# EAGLE design Router (EAGLE 6.3)
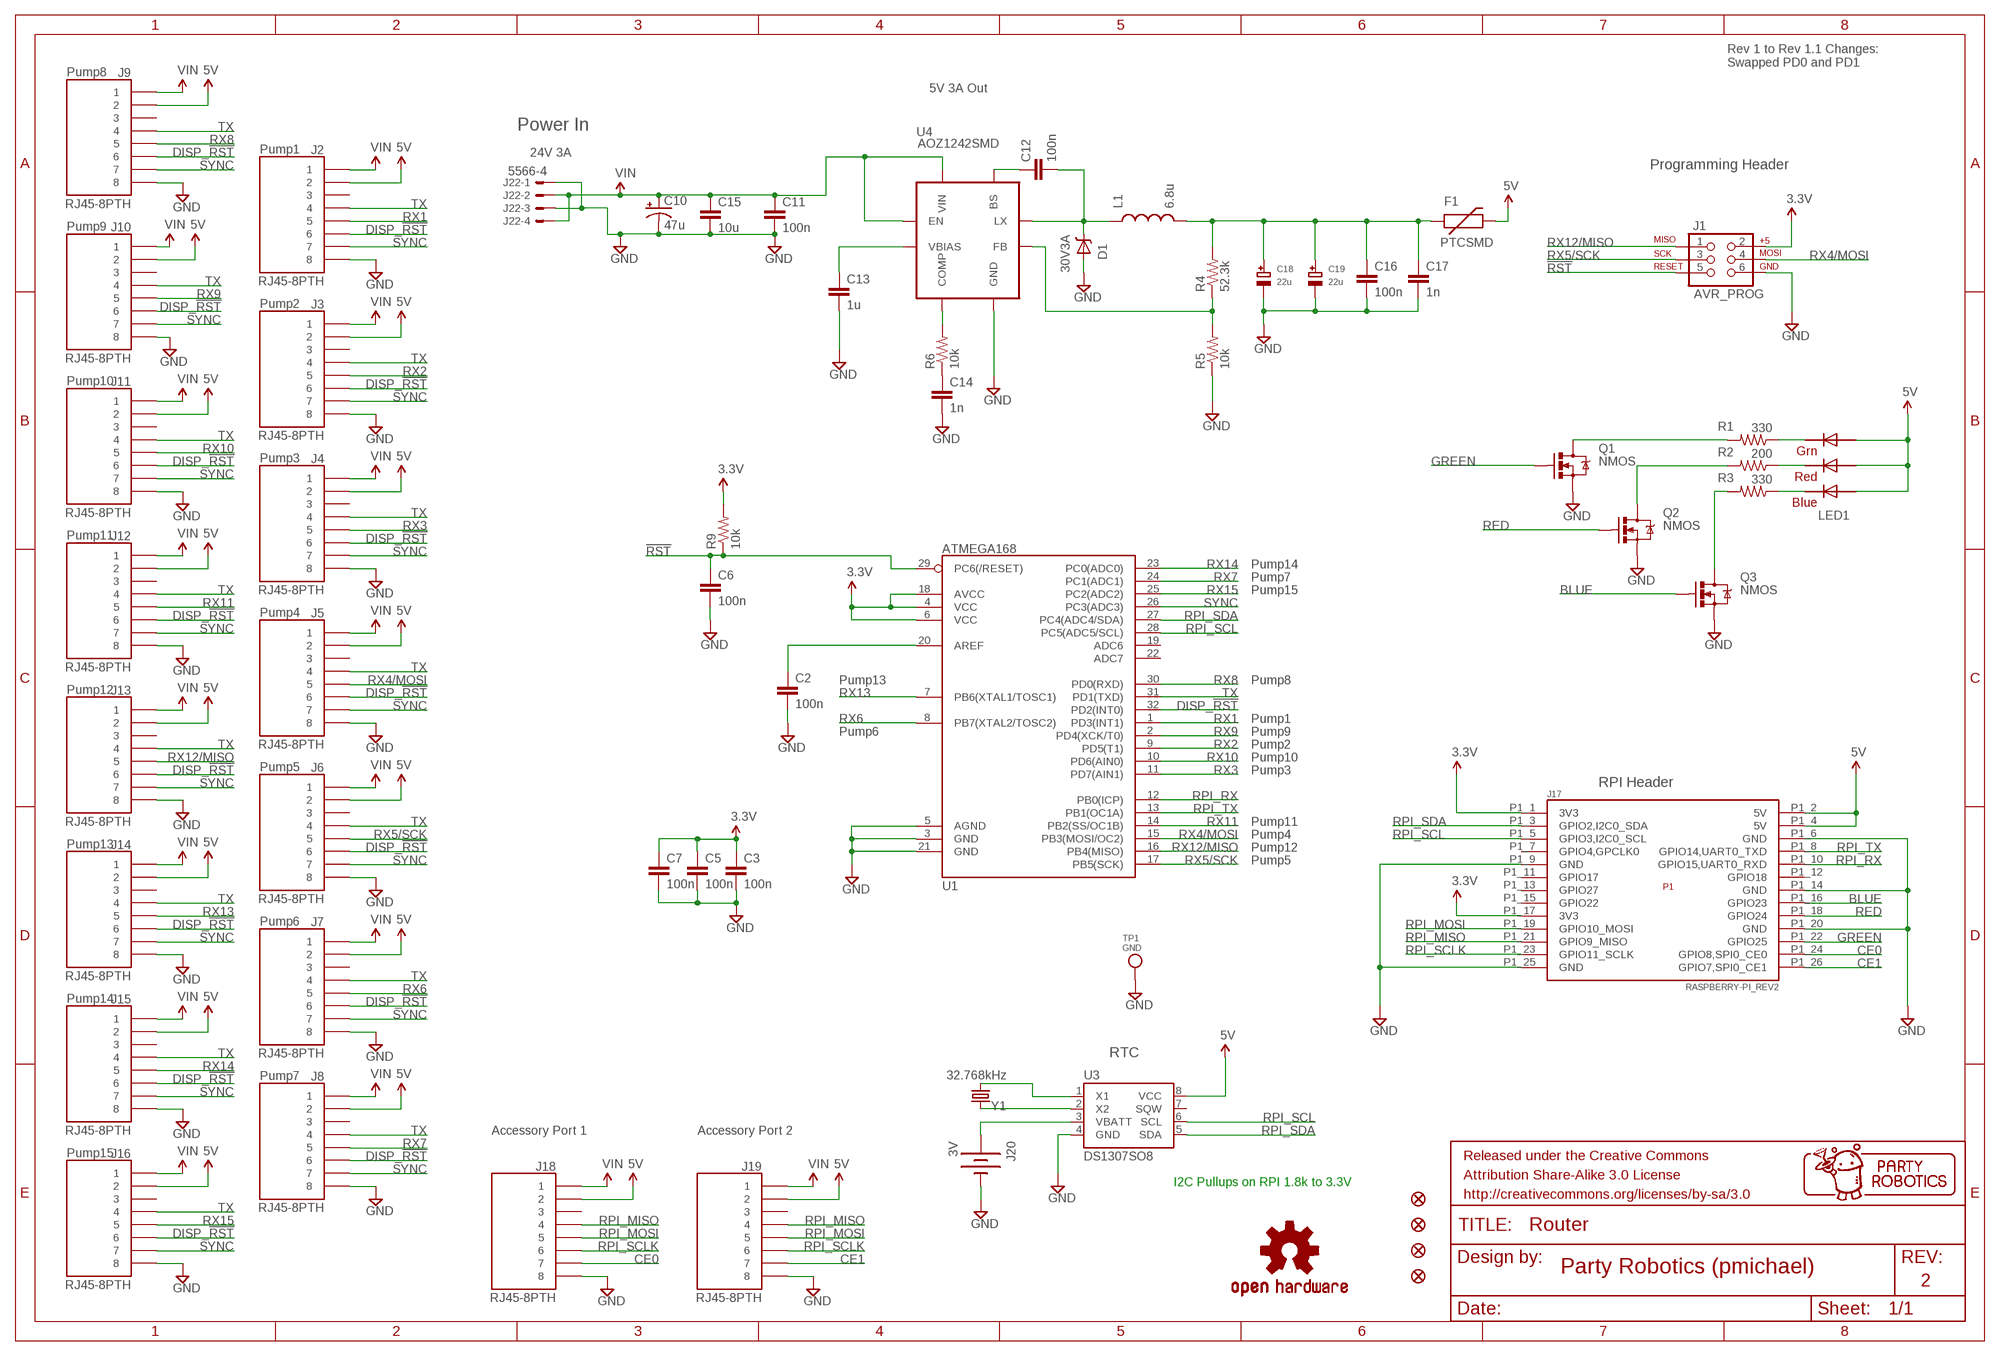
[diagram p0: schematic, sheet 1]

## Parts
C2  100n  CAP0603-CAP  [0603-CAP]
C3  100n  CAP0603-CAP  [0603-CAP]
C5  100n  CAP0603-CAP  [0603-CAP]
C6  100n  CAP0603-CAP  [0603-CAP]
C7  100n  CAP0603-CAP  [0603-CAP]
C10  47u  CAP_POLD  [PANASONIC_D]
C11  100n  CAP0603-CAP  [0603-CAP]
C12  100n  CAP0603-CAP  [0603-CAP]
C13  1u  CAP0603-CAP  [0603-CAP]
C14  1n  CAP0603-CAP  [0603-CAP]
C15  10u  CAP1206  [1206]
C16  100n  CAP0603-CAP  [0603-CAP]
C17  1n  CAP0603-CAP  [0603-CAP]
C18  22u  CAP_TANTALUMC/6032_REFLOW  [EIA6032-28/C-R]
C19  22u  CAP_TANTALUMC/6032_REFLOW  [EIA6032-28/C-R]
D1  30V3A  B330A  [SMA-DIODE]
F1  PTCSMD  [PTC-1206]
FRAME3  FRAME-LETTER  [CREATIVE_COMMONS]
J1  AVR_PROG  AVR_SPI_PRG_62X3_LOCK  [2X3_LOCK]
J2  RJ45-8PTH  [RJ45-8]
J3  RJ45-8PTH  [RJ45-8]
J4  RJ45-8PTH  [RJ45-8]
J5  RJ45-8PTH  [RJ45-8]
J6  RJ45-8PTH  [RJ45-8]
J7  RJ45-8PTH  [RJ45-8]
J8  RJ45-8PTH  [RJ45-8]
J9  RJ45-8PTH  [RJ45-8]
J10  RJ45-8PTH  [RJ45-8]
J11  RJ45-8PTH  [RJ45-8]
J12  RJ45-8PTH  [RJ45-8]
J13  RJ45-8PTH  [RJ45-8]
J14  RJ45-8PTH  [RJ45-8]
J15  RJ45-8PTH  [RJ45-8]
J16  RJ45-8PTH  [RJ45-8]
J17  RASPBERRY-PI_REV2  [RASPBERRY-PI_REV2]
J18  RJ45-8PTH  [RJ45-8]
J19  RJ45-8PTH  [RJ45-8]
J20  3V  BATTERY12PTH  [BATTCON_12MM_PTH]
J22  5566-4  [5566-4]
JP1  FIDUCIAL1.5X3  [FIDUCIAL-1.5X3]
JP2  FIDUCIAL1.5X3  [FIDUCIAL-1.5X3]
JP3  FIDUCIAL1.5X3  [FIDUCIAL-1.5X3]
JP4  FIDUCIAL1.5X3  [FIDUCIAL-1.5X3]
L1  6.8u  INDUCTORCR54  [IND_8X8X4]
LED1  RGBLED5050  [RGBLED5050]
Q1  NMOS  MOSFET-NCHANNELSMD  [SOT23-3]
Q2  NMOS  MOSFET-NCHANNELSMD  [SOT23-3]
Q3  NMOS  MOSFET-NCHANNELSMD  [SOT23-3]
R1  330  RESISTOR0603-RES  [0603-RES]
R2  200  RESISTOR0603-RES  [0603-RES]
R3  330  RESISTOR0603-RES  [0603-RES]
R4  52.3k  RESISTOR0603-RES  [0603-RES]
R5  10k  RESISTOR0603-RES  [0603-RES]
R6  10k  RESISTOR0603-RES  [0603-RES]
R9  10k  RESISTOR0603-RES  [0603-RES]
TP1  GND  TESTPOINT  [TESTPOINT_SMT]
U1  ATMEGA168  [TQFP32-08]
U3  DS1307SO8  [SO08]
U4  AOZ1242SMD  [SO08]
U$46  OSHW-LOGOM  [OSHW-LOGO-M]
Y1  32.768kHz  CRYSTALTC26H_EZ  [TC26HEZ]

## Nets
3.3V: C3.1 C5.1 C7.1 J1.2 J17.P1_1(3V3) J17.P1_17(3V3) R9.2 U1.4(VCC) U1.6(VCC) U1.18(AVCC)
5V: F1.2 J2.2 J3.2 J4.2 J5.2 J6.2 J7.2 J8.2 J9.2 J10.2 J11.2 J12.2 J13.2 J14.2 J15.2 J16.2 J17.P1_2(5V) J17.P1_4(5V) J18.2 J19.2 LED1.1(BLUE_A) LED1.2(RED_A) LED1.3(GREEN_A) U3.8(VCC)
!RST: C6.1 J1.5 R9.1 U1.29(PC6(/RESET))
BAT1+: J20.VCC@1(+) U3.3(VBATT)
BLUE: J17.P1_16(GPIO23) Q3.1(G)
CE0: J17.P1_24(GPIO8,SPI0_CE0) J18.7
CE1: J17.P1_26(GPIO7,SPI0_CE1) J19.7
DISP_!RST: J2.6 J3.6 J4.6 J5.6 J6.6 J7.6 J8.6 J9.6 J10.6 J11.6 J12.6 J13.6 J14.6 J15.6 J16.6 U1.32(PD2(INT0))
GND: C2.2 C3.2 C5.2 C6.2 C7.2 C10.- C11.2 C13.2 C14.2 C15.2 C16.2 C17.2 C18.- C19.- D1.A J1.6 J2.8 J3.8 J4.8 J5.8 J6.8 J7.8 J8.8 J9.8 J10.8 J11.8 J12.8 J13.8 J14.8 J15.8 J16.8 J17.P1_6(GND) J17.P1_9(GND) J17.P1_14(GND) J17.P1_20(GND) J17.P1_25(GND) J18.8 J19.8 J20.GND(-) J22.1 J22.3 Q1.2(S) Q2.2(S) Q3.2(S) R5.1 TP1.P$1 U1.3(GND) U1.5(AGND) U1.21(GND) U3.4(GND) U4.3(GND)
GREEN: J17.P1_22(GPIO25) Q1.1(G)
N$1: U3.2(X2) Y1.1
N$2: R4.1 R5.2 U4.4(FB)
N$3: R6.2 U4.5(COMP)
N$4: C2.1 U1.20(AREF)
N$5: C16.1 C17.1 C18.+ C19.+ F1.1 L1.P$2 R4.2
N$6: U3.1(X1) Y1.2
N$7: C12.1 U4.2(BS)
N$8: C13.1 U4.8(VBIAS)
N$9: LED1.4(GREEN_C) R1.1
N$10: Q1.3(D) R1.2
N$11: Q2.3(D) R2.2
N$12: LED1.5(RED_C) R2.1
N$13: LED1.6(BLUE_C) R3.1
N$14: Q3.3(D) R3.2
N$15: C14.1 R6.1
N$16: C12.2 D1.C L1.P$1 U4.1(LX)
RED: J17.P1_18(GPIO24) Q2.1(G)
RPI_MISO: J17.P1_21(GPIO9_MISO) J18.4 J19.4
RPI_MOSI: J17.P1_19(GPIO10_MOSI) J18.5 J19.5
RPI_RX: J17.P1_10(GPIO15,UART0_RXD) U1.12(PB0(ICP))
RPI_SCL: J17.P1_5(GPIO3,I2C0_SCL) U1.28(PC5(ADC5/SCL)) U3.6(SCL)
RPI_SCLK: J17.P1_23(GPIO11_SCLK) J18.6 J19.6
RPI_SDA: J17.P1_3(GPIO2,I2C0_SDA) U1.27(PC4(ADC4/SDA)) U3.5(SDA)
RPI_TX: J17.P1_8(GPIO14,UART0_TXD) U1.13(PB1(OC1A))
RX1: J2.5 U1.1(PD3(INT1))
RX2: J3.5 U1.9(PD5(T1))
RX3: J4.5 U1.11(PD7(AIN1))
RX4/MOSI: J1.4 J5.5 U1.15(PB3(MOSI/OC2))
RX5/SCK: J1.3 J6.5 U1.17(PB5(SCK))
RX6: J7.5 U1.8(PB7(XTAL2/TOSC2))
RX7: J8.5 U1.24(PC1(ADC1))
RX8: J9.5 U1.30(PD0(RXD))
RX9: J10.5 U1.2(PD4(XCK/T0))
RX10: J11.5 U1.10(PD6(AIN0))
RX11: J12.5 U1.14(PB2(SS/OC1B))
RX12/MISO: J1.1 J13.5 U1.16(PB4(MISO))
RX13: J14.5 U1.7(PB6(XTAL1/TOSC1))
RX14: J15.5 U1.23(PC0(ADC0))
RX15: J16.5 U1.25(PC2(ADC2))
SYNC: J2.7 J3.7 J4.7 J5.7 J6.7 J7.7 J8.7 J9.7 J10.7 J11.7 J12.7 J13.7 J14.7 J15.7 J16.7 U1.26(PC3(ADC3))
TX: J2.4 J3.4 J4.4 J5.4 J6.4 J7.4 J8.4 J9.4 J10.4 J11.4 J12.4 J13.4 J14.4 J15.4 J16.4 U1.31(PD1(TXD))
VIN: C10.+ C11.1 C15.1 J2.1 J3.1 J4.1 J5.1 J6.1 J7.1 J8.1 J9.1 J10.1 J11.1 J12.1 J13.1 J14.1 J15.1 J16.1 J18.1 J19.1 J22.2 J22.4 U4.6(EN) U4.7(VIN)
Unconnected: J2.3 J3.3 J4.3 J5.3 J6.3 J7.3 J8.3 J9.3 J10.3 J11.3 J12.3 J13.3 J14.3 J15.3 J16.3 J17.P1_7(GPIO4,GPCLK0) J17.P1_11(GPIO17) J17.P1_12(GPIO18) J17.P1_13(GPIO27) J17.P1_15(GPIO22) J18.3 J19.3 U1.19(ADC6) U1.22(ADC7) U3.7(SQW)

## Notes on the sheet
- Rev 1 to Rev 1.1 Changes:
  Swapped PD0 and PD1
- Pump8
- 5V 3A Out
- Power In
- Pump1 | 24V 3A
- Programming Header
- Pump9
- Pump2
- Pump10
- Pump3
- Pump11
- Pump14
- Pump7
- Pump15
- Pump4
- Pump13 | Pump8
- Pump12
- Pump1
- Pump6 | Pump9
- Pump2
- Pump10
- Pump5 | Pump3
- RPI Header
- Pump11
- Pump4
- Pump13 | Pump12
- Pump5
- Pump6
- Pump14
- RTC
- Pump7
- Accessory Port 1 | Accessory Port 2
- Pump15
- I2C Pullups on RPI 1.8k to 3.3V
- Party Robotics (pmichael)
- 2

## Library data of the parts
C2 C3 C5-C7 C11-C14 C16 C17 = SparkFun:CAP: Capacitor Standard 0603 ceramic capacitor, and 0.1" leaded capacitor.
C10 = SparkFun-Capacitors:CAP_POL: Capacitor Polarized These are standard SMD and PTH capacitors. Normally 10uF, 47uF, and 100uF in electrolytic and tantalum varieties. Always verify the external diameter of the through hole cap, it varies with capacity, voltage, and manufacturer. The EIA devices should be standard.
C15 = SparkFun-Capacitors:CAP: Capacitor Standard 0603 ceramic capacitor, and 0.1" leaded capacitor.
C18 C19 = microbuilder:CAP_TANTALUM: Tantalum Capacitors Wave footprints have larger pads and are meant to be used for hand soldering. Reflow footprints are optimised for solder paste and a reflow oven. EIA3216-18/A-[R/W] - Size A / 3216-18 / 1206 footprint 4.7µF 25V 10% Tantalum Capacitor 10µF 16V 10% Tantalum Capacitor [Digikey: 495-2236-2-ND] EIA3528-21/B-[R/W] - Size B / 3528-21 47µF 10V 10% Tantalum Capactior [Digikey: 495-2216-1-ND] EIA6032-28/C-[R/W] - Size C / 6032-28 10µF 35V 20% Tantalum Capacitor [Digikey: 495-2285-1-ND] 100µF 16V 10% Tantalum Capactior [Digikey: 399-5214-1-ND]
D1 = pierre:B330A: Schottky Diode 3A-30V; PROD_ID: DIO-09886
F1 = SparkFun-PowerIC:PTC: Resettable Fuse PTC Resettable Fuse. Spark Fun Electronics SKU : COM-08357
FRAME3 = SparkFun-Aesthetics:FRAME-LETTER: Schematic Frame Standard 8.5x11 US Letter frame
J1 = SparkFun-Connectors:AVR_SPI_PRG_6: AVR ISP 6 Pin This is the reduced ISP connector for AVR programming. Common on Arduino. This footprint will take up less PCB space and can be used with a 10-pin to 6-pin adapter such as SKU: BOB-08508
J2-J16 J18 J19 = pierre:RJ45-8: RJ45 Jack Simple RJ45, 8-pin connection - connector for common Cat5, Cat5e, and Cat6 Ethernet cables. Footprint not yet proven in production. Connector sku is PRT-00643; Breakout PCB sku is BOB-00716.; DIST: DigiKey; DIST_PN: 151-1099-ND; MFG: EDAC Inc; MFG_PN: A00-108-220-450
J17 = pierre:RASPBERRY-PI_REV2: Raspberry Pi Board <http://www.raspberrypi.org/> Jacques Lagnel V1.0 (beta) 2012 Mateusz Bawaj V1.1 (beta) 2012 Board dimension: Forum 3D model <http://www.raspberrypi.org/forum/general-discussion/mechanical-profile-3d-models?value=3d%20model&type=1&include=1&search=1&ret=all> The GPIO Connector (P1): http://elinux.org/RPi_Low-level_peripherals The GPIO Connector (P5): http://www.raspberrypi-spy.co.uk/2012/09/raspberry-pi-p5-header/
J20 = SparkFun-Electromechanical:BATTERY: Battery Holders Various common sizes : AA, AAA, 20mm coin cell and 12mm coin cell.
J22 = pierre:5566-4: Mini FIT connector 4 pol Source: http://www.molex.com; OC_FARNELL: unknown; OC_NEWARK: unknown
JP1-JP4 = SparkFun-Aesthetics:FIDUCIAL: Fiducial Alignment Points Various fiducial points for machine vision alignment.
L1 = pierre:INDUCTOR: Inductors Basic Inductor/Choke - 0603 and 1206. Footprints are not proven and vary greatly between part numbers.
LED1 = pierre:RGBLED: For 5050 RGB LEDs, the order of the LEDs may vary from one manufacturer to another!
Q1-Q3 = SparkFun-DiscreteSemi:MOSFET-NCHANNEL: Generic NMOS footprint
R1-R6 R9 = SparkFun-Resistors:RESISTOR: Resistor Basic schematic elements and footprints for 0603, 1206, and PTH resistors.
TP1 = microbuilder:TESTPOINT: Test Point Various test points for characterisation and PCB testing TESTPOINT_SMT - Compact Surface Mount Test Point [Digikey: 5016KTR-ND]
U1 = SparkFun-DigitalIC:ATMEGA168: Atmel 32-pin 8-bit micro, 16k flash.
U3 = SparkFun-FreqCtrl:DS1307: I2C real-time clock with battery backup.
U4 = pierre:AOZ1242: Jellybean switching supply controller
U$46 = SparkFun-Aesthetics:OSHW-LOGO: Open Source Hardware Logo This logo indicates the piece of hardware it is found on incorporates a OSHW license and/or adheres to the definition of open source hardware found here: http://freedomdefined.org/OSHW
Y1 = pierre:CRYSTAL: Various standard crystals. Proven footprints. Spark Fun Electronics SKU : COM-00534

## Board
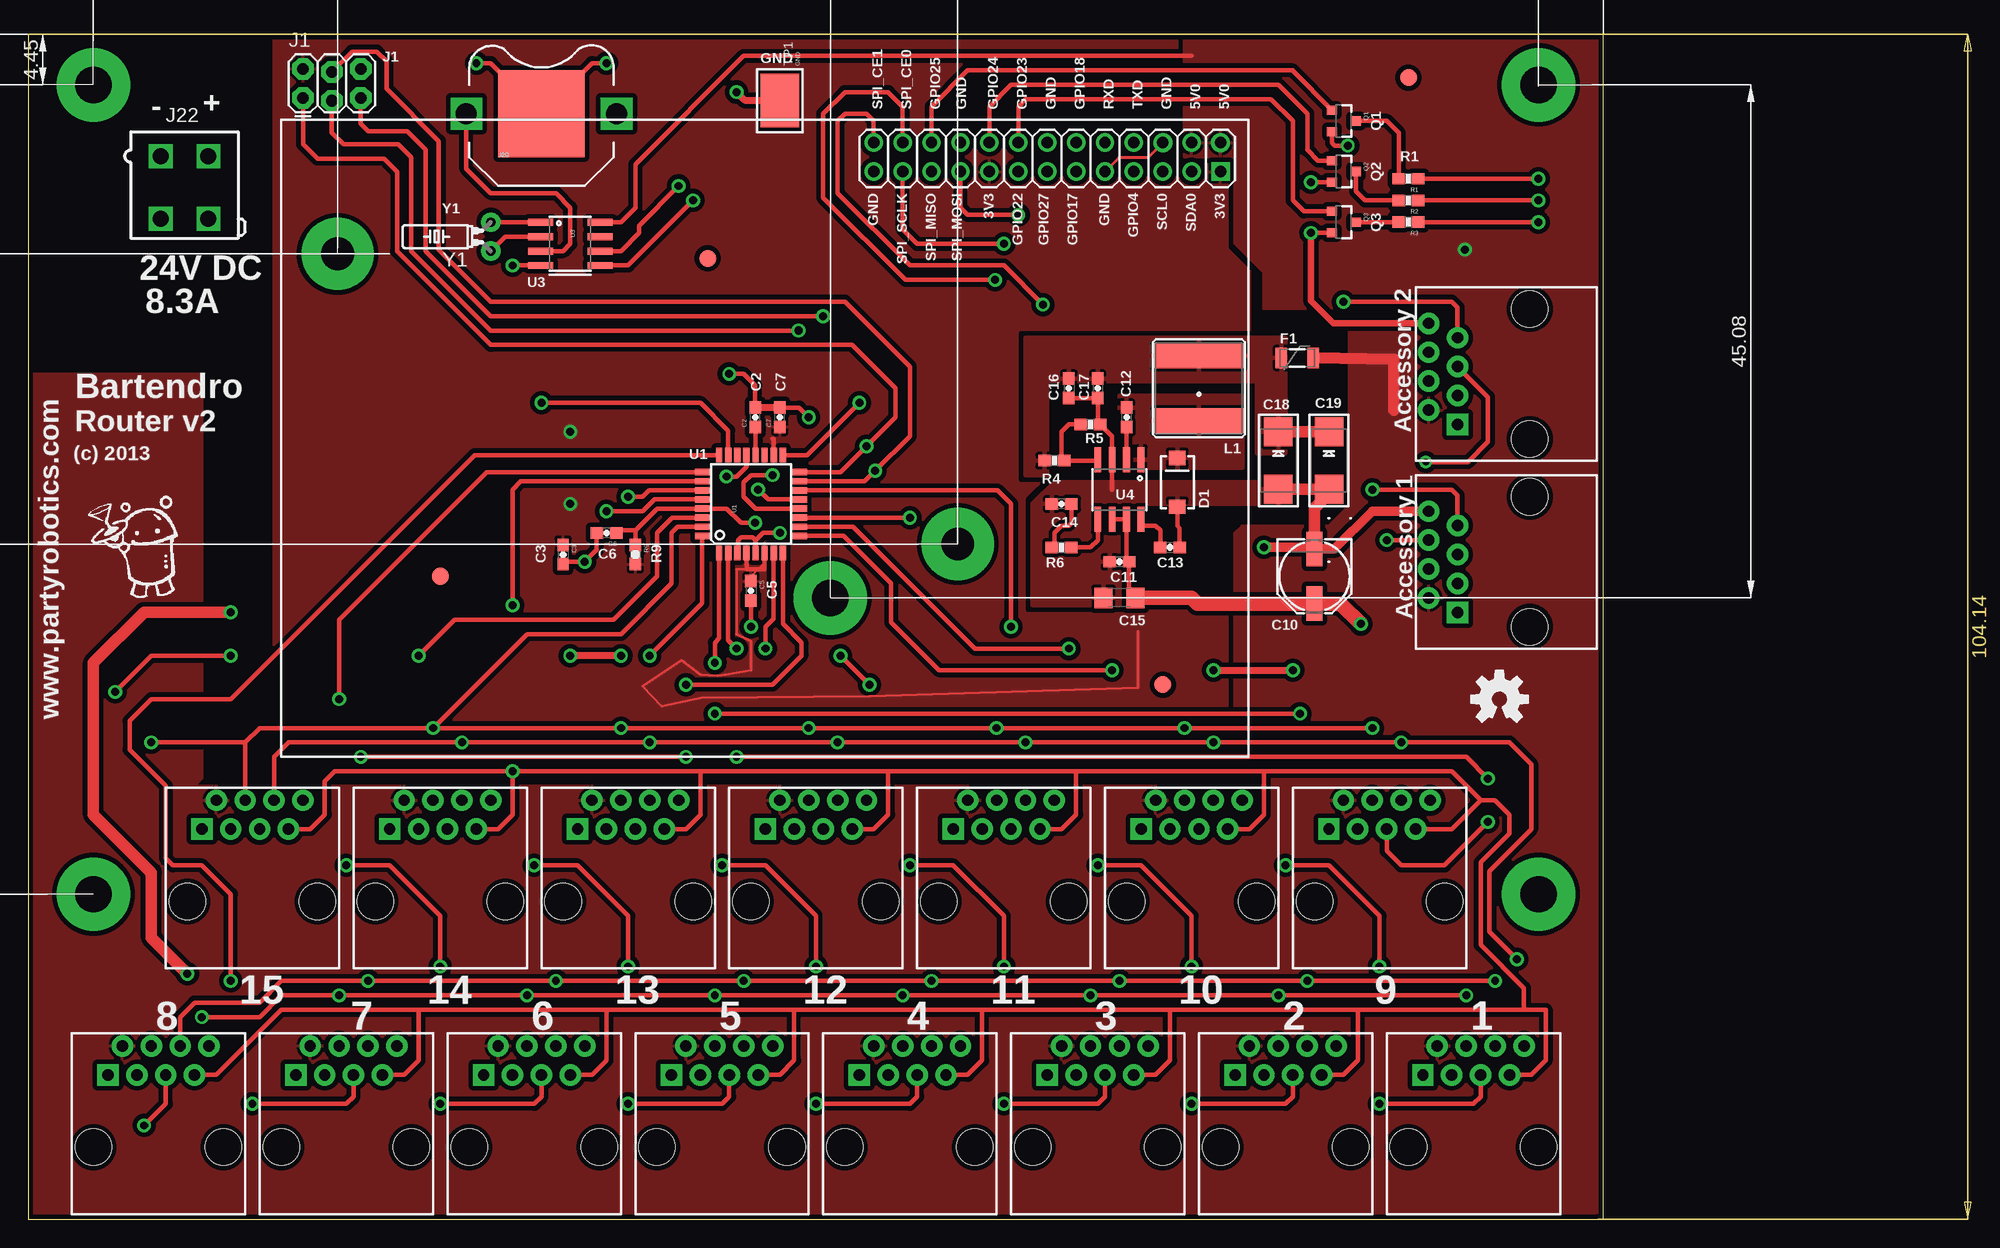
[diagram p1: board, top side]
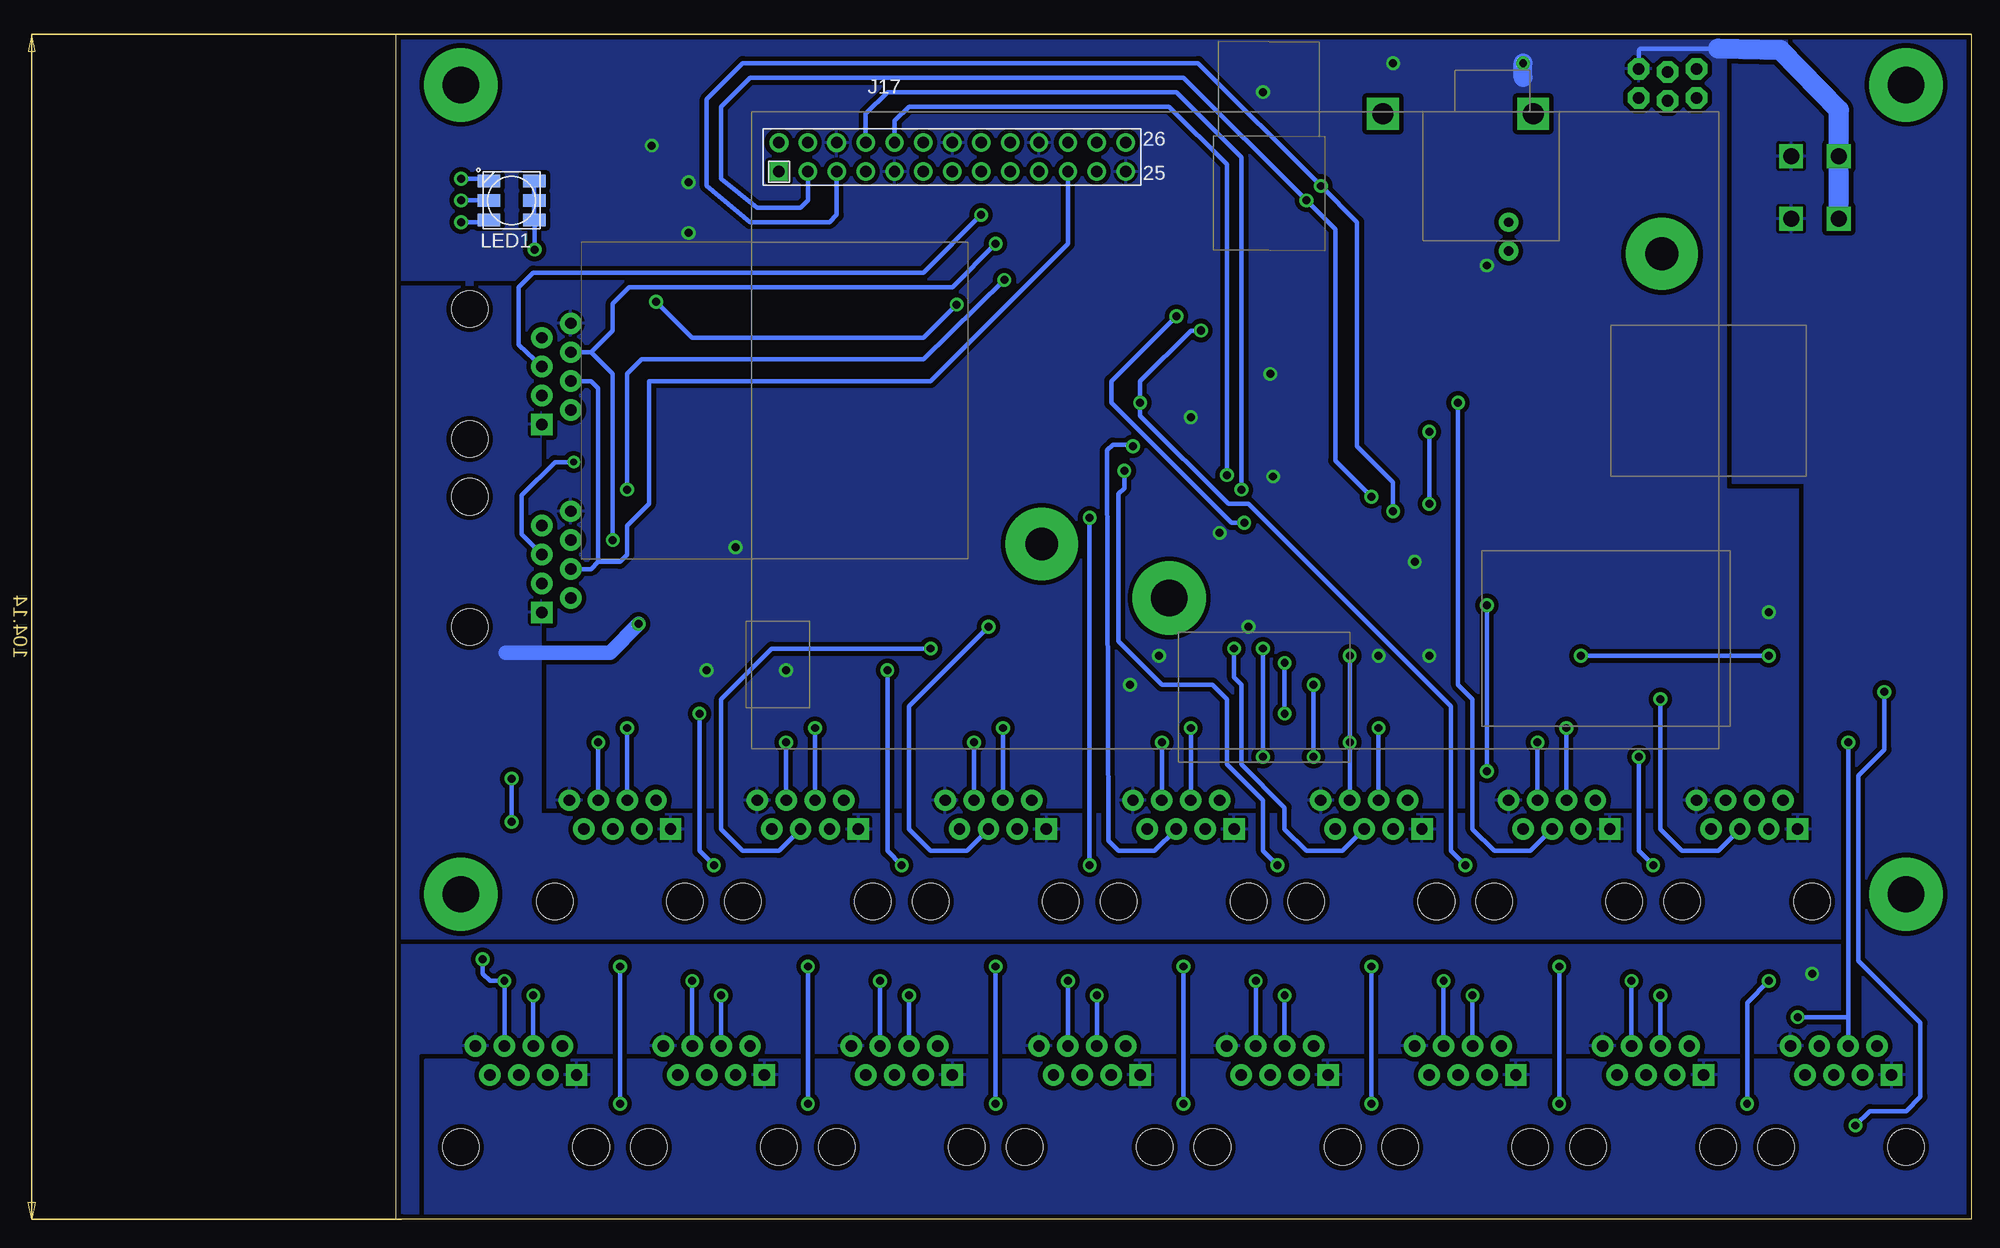
[diagram p2: board, bottom side, seen from below]

Size 138.43 x 104.14 mm. Coordinates in mm from the lower left corner, seen from the top.
Outline: 0,104.14 0,0 138.43,0 138.43,104.14 0,104.14
Copper layers (1*16): Top 0.035mm / dielectric 1.5mm / Bottom 0.035mm
Design rules "SparkFun *": minimum track width 8mil, minimum drill 20mil, track to track 8mil, track to pad 8mil, pad to pad 8mil, via to via 8mil, smd to smd 8mil, copper to edge 10mil, drill to drill 8mil, minimum pad ring 12mil, minimum via ring 10mil, stop-mask expansion 4mil, vias tented up to drill 25mil, thermal gap 10mil

### Footprints (pad centres in the part's own frame; a part is rotated, then mirrored left to right if it is on the bottom)
0603-CAP = smd 1.1 x 1: 1 -0.85,0; 2 0.85,0
PANASONIC_D = smd 3 x 1.4: + 2.4,0; - -2.4,0
1206 = smd 1.6 x 1.8: 1 -1.4,0; 2 1.4,0
EIA6032-28/C-R = smd 2.55 x 2.5: + 2.525,0; - -2.525,0
SMA-DIODE = smd 1.27 x 1.47: A -2.15,0; C 2.15,0
PTC-1206 = smd 1 x 1.8: 1 -1.4,0; 2 1.4,0
2X3_LOCK = drill 1.016 pad 1.88 octagon: 1 0,0; 2 0,2.54; 3 2.54,-0.254; 4 2.54,2.286; 5 5.08,0; 6 5.08,2.54
RJ45-8 = drill 1 pad 1.88 square: 1 -4.445,6.35 | drill 1 pad 1.88: 2 -3.175,8.89; 3 -1.905,6.35; 4 -0.635,8.89; 5 0.635,6.35; 6 1.905,8.89; 7 3.175,6.35; 8 4.445,8.89 | hole 3.2: -5.715,0; 5.715,0
RASPBERRY-PI_REV2 = drill 1 square: P1_1 -41.91,21.59 | drill 1 pad 1.676: P1_2 -41.91,24.13; P1_6 -36.83,24.13 | drill 1: P1_3 -39.37,21.59; P1_4 -39.37,24.13; P1_5 -36.83,21.59; P1_7 -34.29,21.59; P1_8 -34.29,24.13; P1_9 -31.75,21.59; P1_10 -31.75,24.13; P1_11 -29.21,21.59; P1_12 -29.21,24.13; P1_13 -26.67,21.59; P1_14 -26.67,24.13; P1_15 -24.13,21.59; P1_16 -24.13,24.13; P1_17 -21.59,21.59; P1_18 -21.59,24.13; P1_19 -19.05,21.59; P1_20 -19.05,24.13; P1_21 -16.51,21.59; P1_22 -16.51,24.13; P1_23 -13.97,21.59; P1_24 -13.97,24.13; P1_25 -11.43,21.59; P1_26 -11.43,24.13 | drill 2.896 pad 6.35: P$1 -18.81,-11.135; P$2 35.69,14.365
BATTCON_12MM_PTH = smd 7.62 x 7.62: GND 0,0 | drill 1.854 square: VCC@1 -6.604,0; VCC@2 6.604,0
5566-4 = drill 1.4 square: 1 2.1,-2.75; 2 -2.1,-2.75; 3 2.1,2.75; 4 -2.1,2.75
FIDUCIAL-1.5X3 = smd 1.5 x 1.5: 1 0,0
IND_8X8X4 = smd 8 x 2.2: P$1 0,2.85; P$2 0,-2.85
RGBLED5050 = smd 2 x 1.1: 1 -2,1.7; 2 -2,0; 3 -2,-1.7; 4 2,-1.7; 5 2,0; 6 2,1.7
SOT23-3 = smd 0.8 x 0.9: 1 -0.95,-1; 2 0.95,-1; 3 0,1.1
0603-RES = smd 1.1 x 1: 1 -0.85,0; 2 0.85,0
TESTPOINT_SMT = smd 4.7 x 3.4: P$1 0,0
TQFP32-08 = smd 1.27 x 0.559: 1 -4.293,2.8; 2 -4.293,2; 3 -4.293,1.2; 4 -4.293,0.4; 5 -4.293,-0.4; 6 -4.293,-1.2; 7 -4.293,-2; 8 -4.293,-2.8; 17 4.293,-2.8; 18 4.293,-2; 19 4.293,-1.2; 20 4.293,-0.4; 21 4.293,0.4; 22 4.293,1.2; 23 4.293,2; 24 4.293,2.8 | smd 0.559 x 1.27: 9 -2.8,-4.293; 10 -2,-4.293; 11 -1.2,-4.293; 12 -0.4,-4.293; 13 0.4,-4.293; 14 1.2,-4.293; 15 2,-4.293; 16 2.8,-4.293; 25 2.8,4.293; 26 2,4.293; 27 1.2,4.293; 28 0.4,4.293; 29 -0.4,4.293; 30 -1.2,4.293; 31 -2,4.293; 32 -2.8,4.293
SO08 = smd 0.61 x 2.21: 1 -1.905,-2.616; 2 -0.635,-2.616; 3 0.635,-2.616; 4 1.905,-2.616; 5 1.905,2.616; 6 0.635,2.616; 7 -0.635,2.616; 8 -1.905,2.616
TC26HEZ = drill 0.813 pad 1.676: 1 -1.27,0; 2 1.27,0

### Placement (x,y rotation side)
C2  63.88,70.48 90 top
C3  46.99,58.42 270 top
C5  63.5,55.24 270 top
C6  50.8,60.33 180 top
C7  66.04,70.48 90 top
C10  113.03,56.52 270 top
C11  95.89,57.78 180 top
C12  96.52,70.48 90 top
C13  100.33,59.05 0 top
C14  90.81,62.87 180 top
C15  95.89,54.61 180 top
C16  91.44,73.03 270 top
C17  93.98,73.03 270 top
C18  109.86,66.67 90 top
C19  114.3,66.67 90 top
D1  100.97,64.77 90 top
F1  111.51,75.69 0 top
FRAME3  86.61,157.99 180 top  (outside the outline)
J1  24.13,98.55 0 top
J2  127,6.35 0 top
J3  110.49,6.35 0 top
J4  93.98,6.35 0 top
J5  77.47,6.35 0 top
J6  60.96,6.35 0 top
J7  44.45,6.35 0 top
J8  27.94,6.35 0 top
J9  11.43,6.35 0 top
J10  118.75,27.94 0 top
J11  102.23,27.94 0 top
J12  85.72,27.94 0 top
J13  69.22,27.94 0 top
J14  52.7,27.94 0 top
J15  36.2,27.94 0 top
J16  19.68,27.94 0 top
J17  62.87,70.48 0 bottom
J18  131.95,57.78 90 top
J19  131.95,74.3 90 top
J20  45.09,97.16 0 top
J22  13.72,90.68 180 top
JP1  36.2,56.52 180 top
JP2  121.28,100.33 180 top
JP3  99.69,46.99 180 top
JP4  59.69,84.45 180 top
L1  102.87,73.03 180 top
LED1  128.27,89.53 180 bottom
Q1  115.57,96.52 270 top
Q2  115.57,92.08 270 top
Q3  115.57,87.63 270 top
R1  121.28,91.44 180 top
R2  121.28,89.53 180 top
R3  121.28,87.63 180 top
R4  90.17,66.67 180 top
R5  93.34,69.85 180 top
R6  90.81,59.05 0 top
R9  53.34,58.42 270 top
TP1  66.04,98.3 90 top
U1  63.5,62.87 90 top
U3  47.62,85.72 270 top
U4  95.89,64.14 180 top
U$46  129.29,45.72 0 top
Y1  40.64,86.36 90 top

### Tracks (layer width: path | path; a pad name or v marks a point on that pad's centre or on a via)
3.3V  (via drill 0.7)
  Top 0.203: 63.5,56.52 64.7,57.72 64.7,58.49 64.77,58.42 64.77,57.15 62.23,57.15 62.23,51.44 63.5,50.8 63.5,48.26 61.21,47.88 60.58,47.75 59.05,47.88 57.4,49.15 53.98,46.86 55.63,45.09 59.18,45.85 73.91,45.97 97.54,46.74 97.54,51.69
  Top 0.406: U1.18 65.5,68.58 65.41,68.58 | U1.6 64.7,58.49 64.7,57.15 63.1,57.15 U1.4
  Bottom 0.406: v47.62,69.22 v47.62,62.87
  pour Top (isolate 0.406, rank 2): 107.31,104.14 107.31,40.64 21.59,40.64 21.59,104.14
5V  (via drill 0.7)
  Top 0.406: 102.23,102.23 62.87,102.23 53.34,92.71 53.34,88.9 52.07,87.63 U3.8
  Top 1.016: F1.2 120.02,75.56 120.02,71.12
  Bottom 0.406: LED1.3 LED1.2 LED1.1 126.24,87.8 v126.24,85.22
  pour Top (isolate 0.406): 138.43,104.14 138.43,0 0,0 0,74.3 15.24,74.3 15.24,38.73 14.61,38.1 106.05,38.1 106.05,60.33 106.68,60.96 114.3,60.96 116.08,62.74 116.08,80.01 108.58,80.01 108.58,83.19 106.05,85.72 106.05,93.34 101.6,93.34 101.6,104.14
!RST  (via drill 0.7, 0.71)
  Top 0.406: 53.34,60.56 55.24,62.47 U1.29 61.36,62.47 62.61,61.21 v63.88,61.21 | 53.34,60.56 R9.1 | 53.34,60.56 51.65,60.56 C6.1 | v69.85,79.38 40.64,79.38 34.92,85.09 34.92,93.98 33.27,95.63 29.84,95.63 29.21,96.27 J1.5
  Bottom 0.406: v63.88,61.21 65.02,61.21 75.56,71.75 75.56,73.66 v69.85,79.38
BAT1+
  Top 0.406: U3.3 46.99,85.09 47.62,85.72 47.62,88.9 46.35,90.17 40.64,90.17 38.48,92.33 J20.VCC@1
BLUE
  Top 0.406: Q3.1 112.08,88.58 111.12,89.53 111.12,96.52 109.22,98.42 87.63,98.42 87,97.79 J17.P1_16
CE0  (via drill 0.7)
  Top 0.406: v84.96,82.55 77.09,82.55 69.85,89.79 69.85,97.16 71.75,99.06 75.56,99.06 76.83,97.79 J17.P1_24 | v118.11,64.14 125.09,64.14 125.6,63.63 J18.7
  Bottom 0.406: v118.11,64.14 118.11,74.3 116.84,75.56 92.08,75.56 v84.96,82.55
CE1  (via drill 0.7)
  Top 0.406: v89.15,80.39 85.72,83.82 77.47,83.82 71.12,90.17 71.12,96.52 71.75,97.16 73.66,97.16 74.3,96.52 J17.P1_26 | v115.57,80.64 125.09,80.64 125.6,80.14 J19.7
  Bottom 0.406: v115.57,80.64 112.39,77.47 92.08,77.47 v89.15,80.39
DISP_!RST  (via drill 0.7)
  Top 0.406: v128.91,20.95 v112.39,20.95 v95.89,20.95 v79.38,20.95 v62.87,20.95 v46.35,20.95 v29.84,20.95 22.23,20.95 20.32,19.05 14.61,19.05 13.34,17.78 J9.6 | U1.32 59.21,54.13 v54.61,49.53 | v130.81,22.86 128.4,25.27 128.4,30.61 132.08,34.29 132.08,40.01 130.18,41.91 v120.65,41.91 v104.14,41.91 v87.63,41.91 v71.12,41.91 v54.61,41.91 v38.1,41.91 22.86,41.91 21.59,40.64 J16.6
  Bottom 0.406: v54.61,49.53 v54.61,41.91 J14.6 | v130.81,22.86 130.81,21.59 130.18,20.95 v128.91,20.95 J2.6 | J10.6 v120.65,41.91 | J11.6 v104.14,41.91 | J12.6 v87.63,41.91 | J13.6 v71.12,41.91 | J15.6 v38.1,41.91 | J3.6 v112.39,20.95 | J4.6 v95.89,20.95 | J5.6 v79.38,20.95 | J6.6 v62.87,20.95 | J7.6 v46.35,20.95 | J8.6 v29.84,20.95
GND  (via drill 0.7, 0.71)
  Top 0.254: J17.P1_9 95.89,93.34 98.42,93.34 J17.P1_6
  Top 0.406: Q3.2 v112.72,86.68 | Q2.2 v112.71,91.12 | Q1.2 114.57,94.6 114.81,94.36 v115.95,94.36 | C2.2 63.88,73.28 62.87,74.3 v61.59,74.3 | C7.2 67.73,71.33 v68.58,70.48 | U3.4 v42.55,83.82 | v50.8,101.6 49.53,101.6 J20.GND 40.64,101.6 v39.37,101.6 | C5.2 v63.5,52.07 | C6.2 49.95,58.84 v48.9,57.78 47.2,57.78 C3.2 | U1.5 63.9,59.67 | 63.9,59.67 63.63,59.94 62.61,59.94 62.36,59.69 62.36,58.63 U1.3 | U1.21 63.1,66.15 62.23,65.28 v61.34,65.28 | v66.04,60.33 64.55,60.33 63.9,59.67 | C16.2 C17.2 93.98,70.06 R5.1 95.25,68.8 U4.3 95.25,64.14 | D1.A 100.97,60.96 101.18,60.74 C13.2 | v73.91,46.99 v71.37,49.53
  Top 0.559: J19.8 114.68,78.74 112.72,80.71 v112.72,86.68
  Top 0.61: v52.07,49.53 v47.62,49.53 | C7.2 C2.2 | v104.14,48.26 v111.12,48.26 | TP1.P$1 62.99,98.3 v62.23,99.06
  Top 0.813: v108.58,59.05 112.89,59.05 C10.- 114.8,58.91 118.11,62.23 J18.8
  Top 1.016: v13.97,21.59 10.79,24.77 10.79,30.48 5.71,35.56 5.71,48.9 10.16,53.34 v17.78,53.34 | C18.- C19.- 114.3,63.75 113.03,62.48 C10.-
  Bottom 0.406: 22.23,102.87 29.08,102.87 29.21,102.74 J1.6
  Bottom 1.676: 39.37,100.33 v39.37,101.6
  Bottom 1.778: J22.3 J22.1 11.62,97.47 16.76,102.74 22.23,102.87
  pour Bottom (isolate 0.406, rank 2): 138.43,104.14 138.43,0 0,0 0,104.14
  pour Top (isolate 0.305): 111.38,64.77 90.17,64.77 88.27,62.87 88.27,53.98 95.89,53.98 95.89,62.87 111.38,62.87
GREEN
  Top 0.406: Q1.1 111.12,100.92 111.12,100.97 82.55,100.97 79.38,97.79 J17.P1_22
N$1
  Top 0.406: Y1.1 41.91,86.36 U3.2
N$2
  Top 0.406: U4.4 93.9,66.67 R4.1 90.81,66.89 90.81,69.22 91.44,69.85 R5.2
N$3
  Top 0.406: R6.2 93.34,59.05 93.98,59.69 U4.5
N$4
  Top 0.406: C2.1 63.9,70 U1.20
N$5
  Top 1.016: C19.+ C18.+
  pour Top (isolate 0.254): 110.49,67.31 107.95,67.31 107.95,73.66 89.53,73.66 89.53,65.41 87.63,65.41 87.63,77.47 110.49,77.47
N$6
  Top 0.406: U3.1 Y1.2
N$7
  Top 0.406: U4.2 C12.1
N$8
  Top 0.406: C13.1 99.48,60.54 99.06,60.96 97.79,60.96 U4.8
N$9  (via drill 0.7)
  Top 0.406: R1.1 v132.72,91.44
  Bottom 0.406: v132.72,91.44 130.47,91.44 LED1.4
N$10
  Top 0.406: R1.2 120.44,95.47 119.38,96.52 Q1.3
N$11
  Top 0.406: R2.2 117.47,89.53 116.67,90.34 Q2.3
N$12  (via drill 0.7)
  Top 0.406: R2.1 v132.72,89.53
  Bottom 0.406: v132.72,89.53 LED1.5
N$13  (via drill 0.7)
  Top 0.406: R3.1 v132.72,87.63
  Bottom 0.406: v132.72,87.63 130.47,87.63 LED1.6
N$14
  Top 0.406: Q3.3 R3.2
N$15
  Top 0.406: C14.1 91.66,61.17 91.44,60.96 90.81,60.96 90.17,60.33 90.17,59.27 R6.1
N$16
  pour Top (isolate 0.305): 95.89,72.39 106.68,72.39 106.68,66.04 95.89,66.04
N$17  (via drill 3.2 pad 6.45)
  other vias: 5.71,99.69
N$18  (via drill 3.2 pad 6.45)
  other vias: 5.71,28.57
N$19  (via drill 3.2 pad 6.45)
  other vias: 70.48,54.61
N$20  (via drill 3.2 pad 6.45)
  other vias: 132.72,28.57
RED
  Top 0.406: Q2.1 113.35,93.03 112.39,93.98 112.39,97.16 109.86,99.69 86.36,99.69 84.45,97.79 J17.P1_18
RPI_MISO
  Bottom 0.406: 120.65,57.78 121.28,57.15 J18.4 | 120.65,57.78 120.65,73.03 121.28,73.66 J19.4 | 120.65,57.78 118.75,57.78 118.11,58.42 118.11,60.96 116.2,62.87 116.2,73.66 91.44,73.66 79.38,85.72 J17.P1_21
RPI_MOSI  (via drill 0.6, 0.7)
  Top 0.406: v87,88.27 82.55,88.27 81.92,88.9 J17.P1_19 | J19.5 128.27,72.26 128.27,68.33 126.49,66.55 v122.81,66.55
  Bottom 0.406: v87,88.27 92.08,83.19 126.36,83.19 127.64,81.92 127.64,76.83 J19.5 | J18.5 127.38,60.2 127.38,63.63 124.46,66.55 v122.81,66.55
RPI_RX  (via drill 0.7)
  Top 0.406: U1.12 63.9,62.47 62.87,63.5 62.87,64.77 63.5,65.41 v65.41,65.41
  Bottom 0.406: v65.41,65.41 65.41,92.71 70.48,97.79 93.34,97.79 94.61,96.52 J17.P1_10
RPI_SCL  (via drill 0.7)
  Top 0.406: U3.6 52.07,85.09 53.66,86.68 53.66,87.31 v57.15,90.81 | U1.28 55.01,63.27 53.98,62.23 v50.8,62.23
  Bottom 0.406: v50.8,62.23 50.8,64.77 53.98,67.94 53.98,87.63 v57.15,90.81 67.94,101.6 107.95,101.6 111.12,98.42 111.12,90.81 107.31,87.63 100.33,87.63 99.69,88.27 J17.P1_5
RPI_SCLK  (via drill 0.7)
  Top 0.406: v85.72,85.72 78.11,85.72 76.83,87 J17.P1_23 | v119.38,59.69 J18.6
  Bottom 0.406: 121.28,76.2 119.38,74.3 v119.38,59.69 | v85.72,85.72 89.53,81.92 117.93,81.92 119.38,80.47 119.38,78.11 121.28,76.2 | 121.28,76.2 J19.6
RPI_SDA  (via drill 0.7)
  Top 0.406: U3.5 52.7,83.82 v58.42,89.53 | v52.7,63.5 53.98,63.5 54.54,64.06 U1.27
  Bottom 0.406: v52.7,63.5 55.88,66.67 55.88,87 v58.42,89.53 69.22,100.33 107.31,100.33 109.86,97.79 109.86,91.44 106.68,88.9 102.87,88.9 102.23,89.53 J17.P1_3
RPI_TX  (via drill 0.7)
  Top 0.406: U1.13 65,63.27 v64.14,64.14
  Bottom 0.406: v64.14,64.14 64.14,93.34 69.85,99.06 95.25,99.06 97.16,97.16 J17.P1_8
RX1  (via drill 0.7)
  Top 0.406: U1.1 60.7,51.06 60.33,50.69 v60.33,48.9 | v118.75,10.16 127,10.16 127.64,10.79 J2.5 | v118.75,22.23 118.75,26.67 114.3,31.11 v110.49,31.11 | v60.33,44.45 v111.76,44.45
  Bottom 0.406: v118.75,10.16 v118.75,22.23 | v110.49,31.11 111.76,32.38 v111.76,44.45 | v60.33,48.9 v60.33,44.45
RX2  (via drill 0.7)
  Top 0.406: U1.9 71.63,60.06 75.82,55.88 75.82,52.45 80.01,48.26 v95.25,48.26 | v102.23,10.16 110.49,10.16 111.12,10.79 J3.5 | v102.23,22.23 102.23,26.67 97.79,31.11 v93.98,31.11
  Bottom 0.406: v102.23,10.16 v102.23,22.23 | v93.98,31.11 95.25,32.38 v95.25,48.26
RX3  (via drill 0.7)
  Top 0.406: U1.11 v77.47,61.66 | v85.72,10.16 93.98,10.16 94.61,10.79 J4.5 | v85.72,22.23 85.72,26.67 81.28,31.11 v77.47,31.11
  Bottom 0.406: v85.72,10.16 v85.72,22.23 | v77.47,31.11 v77.47,61.66
RX4/MOSI  (via drill 0.7)
  Top 0.406: v69.22,10.16 77.47,10.16 78.11,10.79 J5.5 | v69.22,22.23 69.22,26.67 64.77,31.11 v60.96,31.11 | U1.15 73.5,64.86 v74.42,65.79 77.47,68.83 77.47,74.93 71.75,80.64 40.64,80.64 36.07,85.22 36.07,94.74 31.47,99.34 31.47,101.75 30.61,102.62 28.45,102.62 J1.4
  Bottom 0.406: v69.22,10.16 v69.22,22.23 | v60.96,31.11 62.23,32.38 62.23,36.83 65.41,40.01 65.41,45.72 66.67,46.99 71.12,46.99 74.93,50.8 74.93,63.75 74.42,64.26 v74.42,65.79
RX5/SCK  (via drill 0.7, 0.71)
  Top 0.406: v73.03,71.75 68.43,67.16 U1.17 | v52.7,10.16 60.96,10.16 61.59,10.79 J6.5 | v52.7,22.23 52.7,26.67 48.26,31.11 v44.45,31.11 | v67.69,78.11 40.64,78.11 33.66,85.09 33.66,93.34 32.51,94.49 27.69,94.49 26.67,95.5 J1.3
  Bottom 0.406: v52.7,10.16 v52.7,22.23 | v44.45,31.11 45.72,32.38 45.72,45.09 63.5,62.87 65.28,62.87 73.03,70.61 v73.03,71.75 73.03,73.66 68.58,78.11 v67.69,78.11
RX6  (via drill 0.7)
  Top 0.406: U1.8 66.3,52.33 67.94,50.69 67.94,49.53 65.41,46.99 v57.78,46.99 | v36.2,10.16 44.45,10.16 45.09,10.79 J7.5 | v36.2,22.23 36.2,26.67 31.75,31.11 v27.94,31.11 | v29.21,40.64 v57.78,40.64
  Bottom 0.406: v36.2,10.16 v36.2,22.23 | v27.94,31.11 29.21,32.38 v29.21,40.64 | v57.78,40.64 v57.78,46.99
RX7  (via drill 0.7)
  Top 0.406: v19.68,10.16 27.94,10.16 28.57,10.79 J8.5 | v17.78,20.95 17.78,28.57 15.24,31.11 12.7,31.11 12.06,31.75 12.06,38.1 8.89,41.27 8.89,43.81 10.79,45.72 17.78,45.72 39.22,67.16 U1.24
  Bottom 0.406: v19.68,10.16 19.68,19.05 v17.78,20.95
RX8  (via drill 0.7)
  Top 0.406: v10.16,8.26 12.06,10.16 J9.5 | v34.29,49.53 37.47,52.7 51.44,52.7 55.24,56.52 55.24,60.33 56.59,61.66 U1.30 | v7.62,46.35 10.79,49.53 v17.78,49.53
  Bottom 0.406: v10.16,8.26 8.89,9.53 5.71,9.53 4.45,10.79 4.45,17.27 9.91,22.73 9.91,38.99 7.62,41.27 v7.62,46.35 | v34.29,49.53 v17.78,49.53
RX9  (via drill 0.7)
  Top 0.406: v128.27,38.73 126.36,40.64 v62.23,40.64 | v62.23,50.16 61.5,50.9 U1.2 | v128.27,34.92 124.46,31.11 120.65,31.11 119.38,32.38 J10.5
  Bottom 0.406: v62.23,40.64 v62.23,50.16 | v128.27,38.73 v128.27,34.92
RX10  (via drill 0.7)
  Top 0.406: U1.10 72.48,60.87 83.19,50.16 v91.44,50.16
  Bottom 0.406: v91.44,50.16 105.41,50.16 109.86,45.72 109.86,34.29 107.95,32.38 104.78,32.38 J11.5
RX11  (via drill 0.7)
  Top 0.406: U1.14 85.16,64.06 86.36,62.87 v86.36,52.07
  Bottom 0.406: v86.36,52.07 93.34,45.09 93.34,34.29 91.44,32.38 88.27,32.38 J12.5
RX12/MISO  (via drill 0.7)
  Top 0.406: U1.16 71.38,65.67 v73.66,67.94 76.2,70.48 76.2,73.03 72.39,76.83 40.64,76.83 32.38,85.09 32.38,92.08 31.24,93.22 25.4,93.22 24.13,94.49 J1.1
  Bottom 0.406: v73.66,67.94 73.79,68.07 75.44,68.07 75.95,67.56 75.82,33.27 74.93,32.38 71.75,32.38 J13.5
RX13  (via drill 0.7)
  Top 0.406: U1.7 65.5,52.8 64.77,52.07 v64.77,50.16
  Bottom 0.406: v64.77,50.16 64.77,47.62 64.14,46.99 64.14,40.01 60.33,36.2 60.33,34.29 58.42,32.38 55.24,32.38 J14.5
RX14  (via drill 0.7)
  Top 0.406: U1.23 61.5,69.31 59.05,71.75 v45.09,71.75
  Bottom 0.406: v45.09,71.75 45.09,46.99 43.81,45.72 43.81,34.29 41.91,32.38 38.73,32.38 J15.5
RX15  (via drill 0.7)
  Top 0.406: U1.25 40.27,65.67 27.3,52.7 v27.3,45.72
  Bottom 0.406: v27.3,45.72 27.3,34.29 25.4,32.38 22.23,32.38 J16.5
SYNC  (via drill 0.7)
  Top 0.406: 34.29,18.41 22.23,18.41 16.51,12.7 J9.7 | 34.29,18.41 50.8,18.41 | 50.8,18.41 67.31,18.41 | 67.31,18.41 83.82,18.41 | 83.82,18.41 100.33,18.41 | 116.84,18.41 131.44,18.41 | 131.44,18.41 133.35,18.41 133.35,13.97 132.08,12.7 J2.7 | v42.55,39.37 26.92,39.37 26.04,38.48 26.04,35.56 24.77,34.29 J16.7 | 108.58,39.37 125.09,39.37 127.64,36.83 | 108.58,39.37 92.08,39.37 | 92.08,39.37 75.56,39.37 | 75.56,39.37 59.05,39.37 | 59.05,39.37 v42.55,39.37 | U1.26 43.27,64.86 42.55,64.14 v42.55,53.98 | 116.84,18.41 116.84,13.97 115.57,12.7 J3.7 | 100.33,18.41 100.33,13.97 99.06,12.7 J4.7 | 83.82,18.41 83.82,13.97 82.55,12.7 J5.7 | 50.8,18.41 50.8,13.97 49.53,12.7 J7.7 | 67.31,18.41 67.31,13.97 66.04,12.7 J6.7 | v42.55,39.37 42.55,35.56 41.27,34.29 J15.7 | 59.05,39.37 59.05,35.56 57.78,34.29 J14.7 | 75.56,39.37 75.56,35.56 74.3,34.29 J13.7 | 92.08,39.37 92.08,35.56 90.81,34.29 J12.7 | 108.58,39.37 108.58,35.56 107.31,34.29 J11.7 | 34.29,18.41 34.29,13.97 33.02,12.7 J8.7 | 100.33,18.41 116.84,18.41 | 127.64,36.83 125.09,34.29 J10.7 | 127.64,36.83 128.91,36.83 130.18,35.56 130.18,33.91 127.64,31.37 127.64,24.13 131.44,20.32 131.44,18.41
  Bottom 0.406: v42.55,39.37 v42.55,53.98
TX  (via drill 0.7)
  Top 0.406: v126.36,19.68 v109.86,19.68 v93.34,19.68 v76.83,19.68 v60.33,19.68 v43.81,19.68 v27.3,19.68 22.23,19.68 20.32,17.78 v15.24,17.78 | v118.11,43.18 v101.6,43.18 v85.09,43.18 v68.58,43.18 v52.07,43.18 v35.56,43.18 | v35.56,43.18 20.32,43.18 19.05,41.91 | v10.79,41.91 19.05,41.91 | U1.31 57.05,60.87 56.52,60.33 56.52,55.88 52.07,51.44 43.81,51.44 v35.56,43.18 | J16.4 19.05,41.91
  Bottom 0.406: 10.79,17.78 v10.79,41.91 | v15.24,17.78 10.79,17.78 | J10.4 v118.11,43.18 | J11.4 v101.6,43.18 | J12.4 v85.09,43.18 | J13.4 v68.58,43.18 | J14.4 v52.07,43.18 | J15.4 v35.56,43.18 | J2.4 v126.36,19.68 | J3.4 v109.86,19.68 | J4.4 v93.34,19.68 | J5.4 v76.83,19.68 | J6.4 v60.33,19.68 | J7.4 v43.81,19.68 | J8.4 v27.3,19.68 | J9.4 10.79,17.78
VIN  (via drill 0.71)
  Top 0.406: U4.6 U4.7 96.52,57.78 C11.1 96.73,54.61 C15.1
  Top 1.27: C15.1 102.23,54.61 102.73,54.12 C10.+ 113.04,54.1 115.32,54.1 v117.09,52.32
  Bottom 1.27: v117.09,52.32 119.63,49.78 128.78,49.78
  pour Bottom (isolate 0.406): 125.73,81.92 138.43,81.92 138.43,24.77 9.53,24.77 9.53,11.43 0,11.43 0,104.14 20.95,104.14 20.95,64.77 14.61,64.77 14.61,35.56 125.73,35.56
  pour Bottom (isolate 0.406): 135.89,0 0,0 0,13.97 135.89,13.97
X1  (via drill 3.2 pad 6.45)
  other vias: 132.72,99.69

### Text on the board
_tplace: J1 | GND | + | SPI_CE1 | SPI_CE0 | GPIO25 | GND | GPIO24 | GPIO23 | GND | GPIO18 | RXD | TXD | GND | 5V0 | 5V0 | - | Q1 | R1 | Q2 | GND | SPI_SCLK | SPI_MISO | SPI_MOSI | 3V3 | GPIO22 | GPIO27 | GPIO17 | GND | GPIO4 | SCL0 | SDA0 | 3V3 | Y1 | Q3 | 24V DC | 8.3A | U3 | Accessory 2 | C2 | C7 | Bartendro | Router v2 | (c) 2013 | U1 | Accessory 1 | C3 | C6 | R9 | C5 | www.partyrobotics.com | 15 | 14 | 13 | 12 | 11 | 10 | 9 | 8 | 7 | 6 | 5 | 4 | 3 | 2 | 1